# Altium schematic sheet Sheet1.SchDoc
size A; SheetNumber: 1; SheetTotal: 1
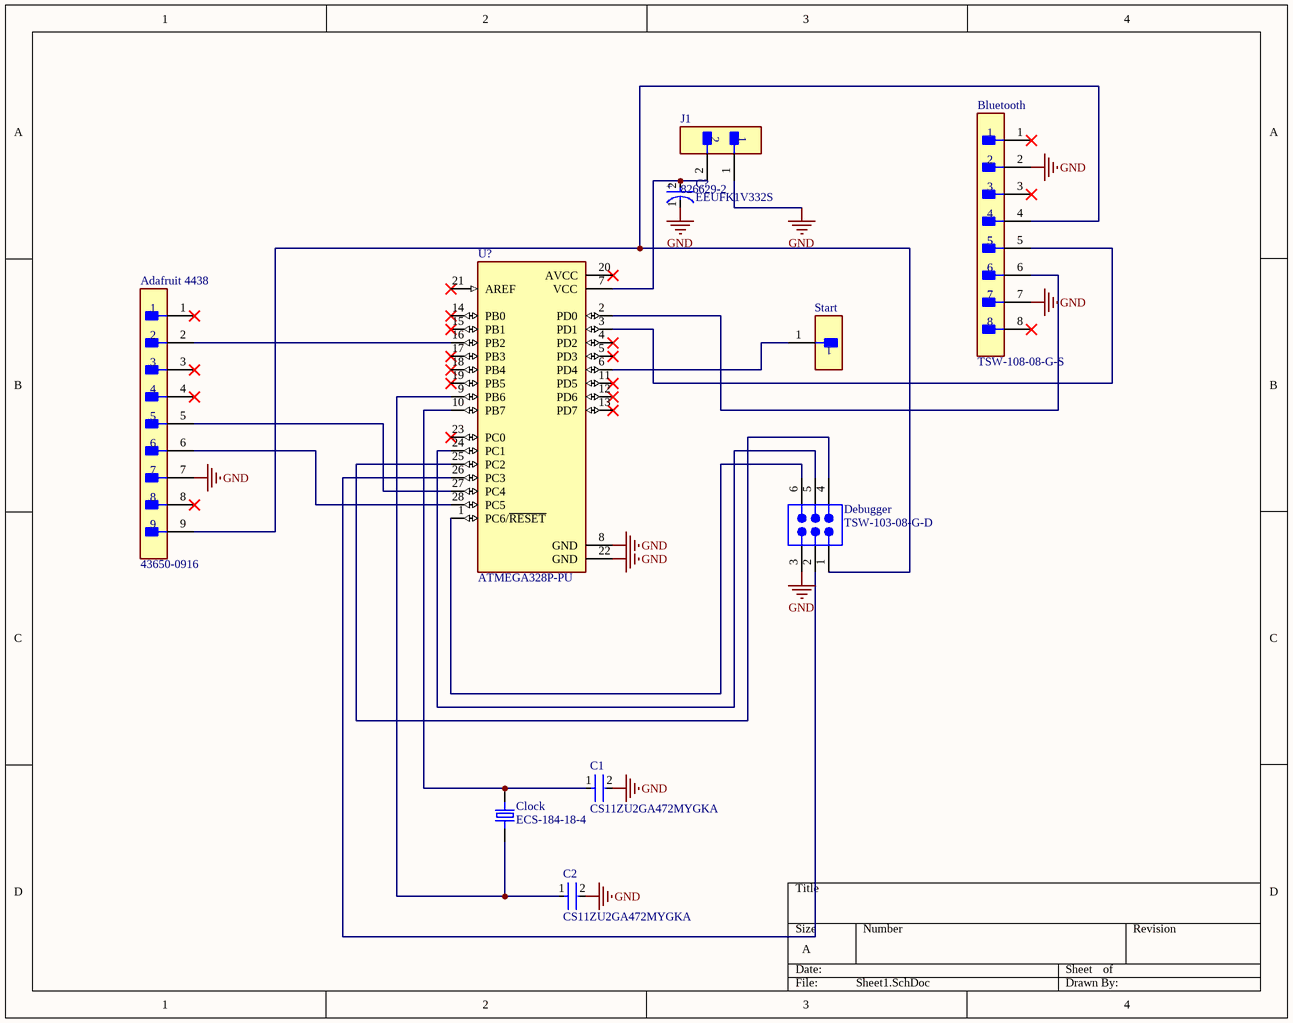
[diagram p0: Sheet1.SchDoc]

## Parts
Adafruit_4438  43650-0916  [FP-43650-0916-MFG]
Bluetooth  TSW-108-08-G-S  [FP-TSW-108-08-G-S-MFG]
C1  CS11ZU2GA472MYGKA  [FP-CS11ZU2GA472MYGKA-MFG]
C2  CS11ZU2GA472MYGKA  [FP-CS11ZU2GA472MYGKA-MFG]
C?  EEUFK1V332S  [FP-RAD-TH-D_18_0_5-L_25_2-MFG]
Clock  ECS-184-18-4  [XTAL_ECS-184-18-4]
Debugger  TSW-103-08-G-D  [SMTC-TSW-103-08-X-D]
J1  826629-2  [FP-826629-2-MFG]
Start  TSW-101-07-L-S  [FP-TSW-101-07-L-S-MFG]  (value not drawn)
U?  ATMEGA328P-PU  [DIP794W46P254L2967H457Q28B]

## Nets
GND: Adafruit_4438.7 Bluetooth.2 Bluetooth.7 C1.2 C2.2 C?.1(C) Debugger.3 J1.1 U?.8(GND) U?.22(GND)
NetAdafruit_4438_2: Adafruit_4438.2 U?.16(PB2)
NetAdafruit_4438_5: Adafruit_4438.5 U?.27(PC4)
NetAdafruit_4438_6: Adafruit_4438.6 U?.28(PC5)
NetAdafruit_4438_9: Adafruit_4438.9 Bluetooth.4 Debugger.1
NetBluetooth_5: Bluetooth.5 U?.3(PD1)
NetBluetooth_6: Bluetooth.6 U?.2(PD0)
NetC1_1: C1.1 Clock.2 U?.10(PB7)
NetC2_1: C2.1 Clock.1 U?.9(PB6)
NetC?_2: C?.2(A) J1.2 U?.7(VCC)
NetDebugger_2: Debugger.2 U?.26(PC3)
NetDebugger_4: Debugger.4 U?.25(PC2)
NetDebugger_5: Debugger.5 U?.24(PC1)
NetDebugger_6: Debugger.6 U?.1(PC6/~{RESET})
NetStart_1: Start.1 U?.6(PD4)

Not connected (* = marked no-connect by the designer): Adafruit_4438 1* 3* 4* 8*; Bluetooth 1* 3* 8*; U? 4(PD2)* 5(PD3)* 11(PD5)* 12(PD6)* 13(PD7)* 14(PB0)* 15(PB1)* 17(PB3)* 18(PB4)* 19(PB5)* 20(AVCC)* 21(AREF)* 23(PC0)*

## Notes on the sheet
- (in symbol CMP-05427-000163-1) +

## Library data of the parts
Adafruit_4438 = CMP-00257-00277538-1: 43650-0916 Conn Power HDR 9 POS 3mm Solder ST Thru-Hole 9 Terminal 1 Port Micro-Fit 3.0™ Frame; NexarPartId: 277538; Manufacturer Lifecycle Status: ACTIVE; Glow Wire Compliant: Compliant; Plating: Tin; Connector Type: Male Pin; Number of Contacts: 9; Gender: Male; Max Voltage Rating (DC): 250.25kV; Current Rating: 5A; Voltage Rating: 600V; Housing Color: Black; Color: Black; Lead Pitch: 3mm; Pitch: 3mm; Number of Positions: 9; Contact Gender: Male; Contact Plating: Gold; Schedule B: 8536695050; Orientation: Vertical; Country of Origin: US; Housing Material: Thermoplastic; Mount: Through Hole; RoHS: Compliant; Halogen Free: Low Halogen; Min Operating Temperature: -40°C; Max Operating Temperature: 105°C; Number of Rows: 1; Contact Material: Brass; Termination: Press-Fit; Lifecycle Status: Production; Fastening Type: Ramp; Lead Free: Contains Lead; Number of Circuits: 9
Bluetooth = CMP-02766-000001-1: CONN HEADER VERT 8POS 2.54MM; Manufacturer: Samtec; Number Of Contacts: 8; Conn Orientation: Straight; Conn Gender: Male; Device Class L1: Connectors; ComponentLink2Description: Datasheet; Digikey Description: CONN HEADER VERT 8POS 2.54MM; ComponentLink2URL: http://suddendocs.samtec.com/catalog_english/tsw_th.pdf; Temperature: -55°C to +125°C; RoHS: TRUE; Mouser Description: TSW - Samtec 2.54mm Pin Header 13.46mm Overall Pin Length 5.08mm Tail; Automotive: No; Temperature Range High: +125°C; Package: TSW-108-08-G-S; Device Class L3: unset; Manufacturer Part Number: TSW-108-08-G-S; Pitch: 2.54mm; Number Of Rows: 1; Lead Free: Yes; Height: 8.71mm; Contact Material: Gold,Nickel; Footprint Url: http://suddendocs.samtec.com/prints/tsw-xxx-xx-x-x-xx-xxx-footprint.pdf; Temperature Range Low: -55°C; Octopart: https://octopart.com/tsw-108-08-g-s-samtec-272653; Category: Conn; Device Class L2: Headers and Wire Housings
C1 C2 = CMP-00600-33723007-1: CS11ZU2GA472MYGKA Cap Ceramic 0.0047uF 440VAC Z5U 20% (10.5 X 5mm) Radial 7.5mm 125°C T/R; Manufacturer Lifecycle Status: PRODUCTION (NOT RECOMMENDED FOR NEW DESIGN); Capacitance: 4.7nF; Ratings: AEC-Q200, X1, Y2; Lead/Base Style: Straight; RoHS: Compliant; Material: Ceramic; Thickness: 5.0038mm; NexarPartId: 33723007; Packaging: Bulk; Min Operating Temperature: -40°C; Mount: Through Hole; Max Operating Temperature: 125°C; Height: 14.5mm; Tolerance: 20%; Lifecycle Status: NRND; Height - Seated (Max): 14.5034mm; Max Thickness: 5mm; Lead Pitch: 7.493mm; Case/Package: Radial
C? = CMP-05427-000163-1: Aluminum Electrolytic Capacitors (Radial Lead Type) AEC-Q200 Qualified 3300uF ±20% 35V; Lead Diameter: 0.8mm; Capacitance: 3.3mF; Ripple Current: 2.85A; Life (Hours): 5000Hour; Dielectric Material: Aluminium; Termination: Radial; Length: 25mm; Max Operating Temperature: 105°C; Number of Pins: 2; Voltage Rating: 35V; RoHS Compliant: Yes; REACH SVHC: No SVHC; Series: FK; Min Operating Temperature: -55°C; Voltage: 35V; Voltage Rating (DC): 35V; Packaging: Bulk; Height: 25mm; Lead Pitch: 7.5mm; Case/Package: Radial; Diameter: 18mm; Package Quantity: 50; Radiation Hardening: No; Construction: RADIAL; Tolerance: 20%; Mount: Through Hole
Debugger = CMP-1024-00338-1: 0.025" SQ Post Header, Through-hole, Vertical, -55 to 125 degC, 2.54 mm Pitch, 6-Pin, Male, RoHS; Manufacturer: Samtec; Pitch: 2.54 mm; ComponentLink1URL: http://www.samtec.com; ComponentLink2URL: http://www.samtec.com/documents/webfiles/pdf/TSW_TH.PDF; Temperature Range: -55 to 125 degC; RoHS: True; ComponentLink2Description: Datasheet; PackageReference: TSW-103-08-X-D; ComponentLink3Description: Package Specification; PackageDescription: .025[0.64] SQ. Post Terminal Strip Assembly; DatasheetVersion: F-214; Mounting Technology: Through-hole; ComponentLink1Description: Manufacturer URL; Orientation: Vertical; PartNumber: TSW-103-08-G-D; PackageVersion: DM, 8/1988; ComponentLink3URL: http://www.samtec.com/documents/webfiles/cpdf/TSW-XXX-XX-XXX-X-XX-XXX-MKT.pdf
J1 = CMP-05178-000003-1: CONN HEADER VERT 2POS 2.54MM; RoHS Compliant: Yes
Start = CMP-02766-001775-1: CONN HEADER VERT 1POS; Gender: Male; Number of Contacts: 1; Max Current Rating: 7.6A; Max Voltage Rating (AC): 550V; RoHS Compliant: Yes; Contact Finish - Mating: GOLD; Length: 2.54mm; Series: TSW; Insulation Material: PBT; Reach SVHC Compliant: Yes; Radiation Hardening: No; Contact Plating: Gold; Termination: Solder; Contact Type: Male Pin; Orientation: Straight; Number of Rows: 1; Depth: 2.54mm; Housing Material: Polyester; Lead Free: Lead Free; Fastening Type: Pull; Flammability Rating: UL94 V-0; Mount: Through Hole; Housing Color: Black; Contact Shape: Square; Min Operating Temperature: -55°C; Connector Type: Header; Contact Mating Length: 0.23inch; Width: 2.54mm; Packaging: Bulk; Contact Material: Bronze; Max Operating Temperature: 125°C; Number of Positions: 1; Color: Black; Insulation Color: Black
U? = ATMEGA328P-PU: ATmega Series 20 MHz 32 KB Flash 2 KB SRAM 8-Bit Microcontroller - DIP-28; MP: ATMEGA328P-PU; Package: None; Availability: Unavailable; Price: None; Value: *
Clock = ECS-184-18-4: Package: None; Price: None; Value: *; MP: ECS-184-18-4; Availability: Unavailable